# EAGLE schematic Display_Node (EAGLE 7.3.0)
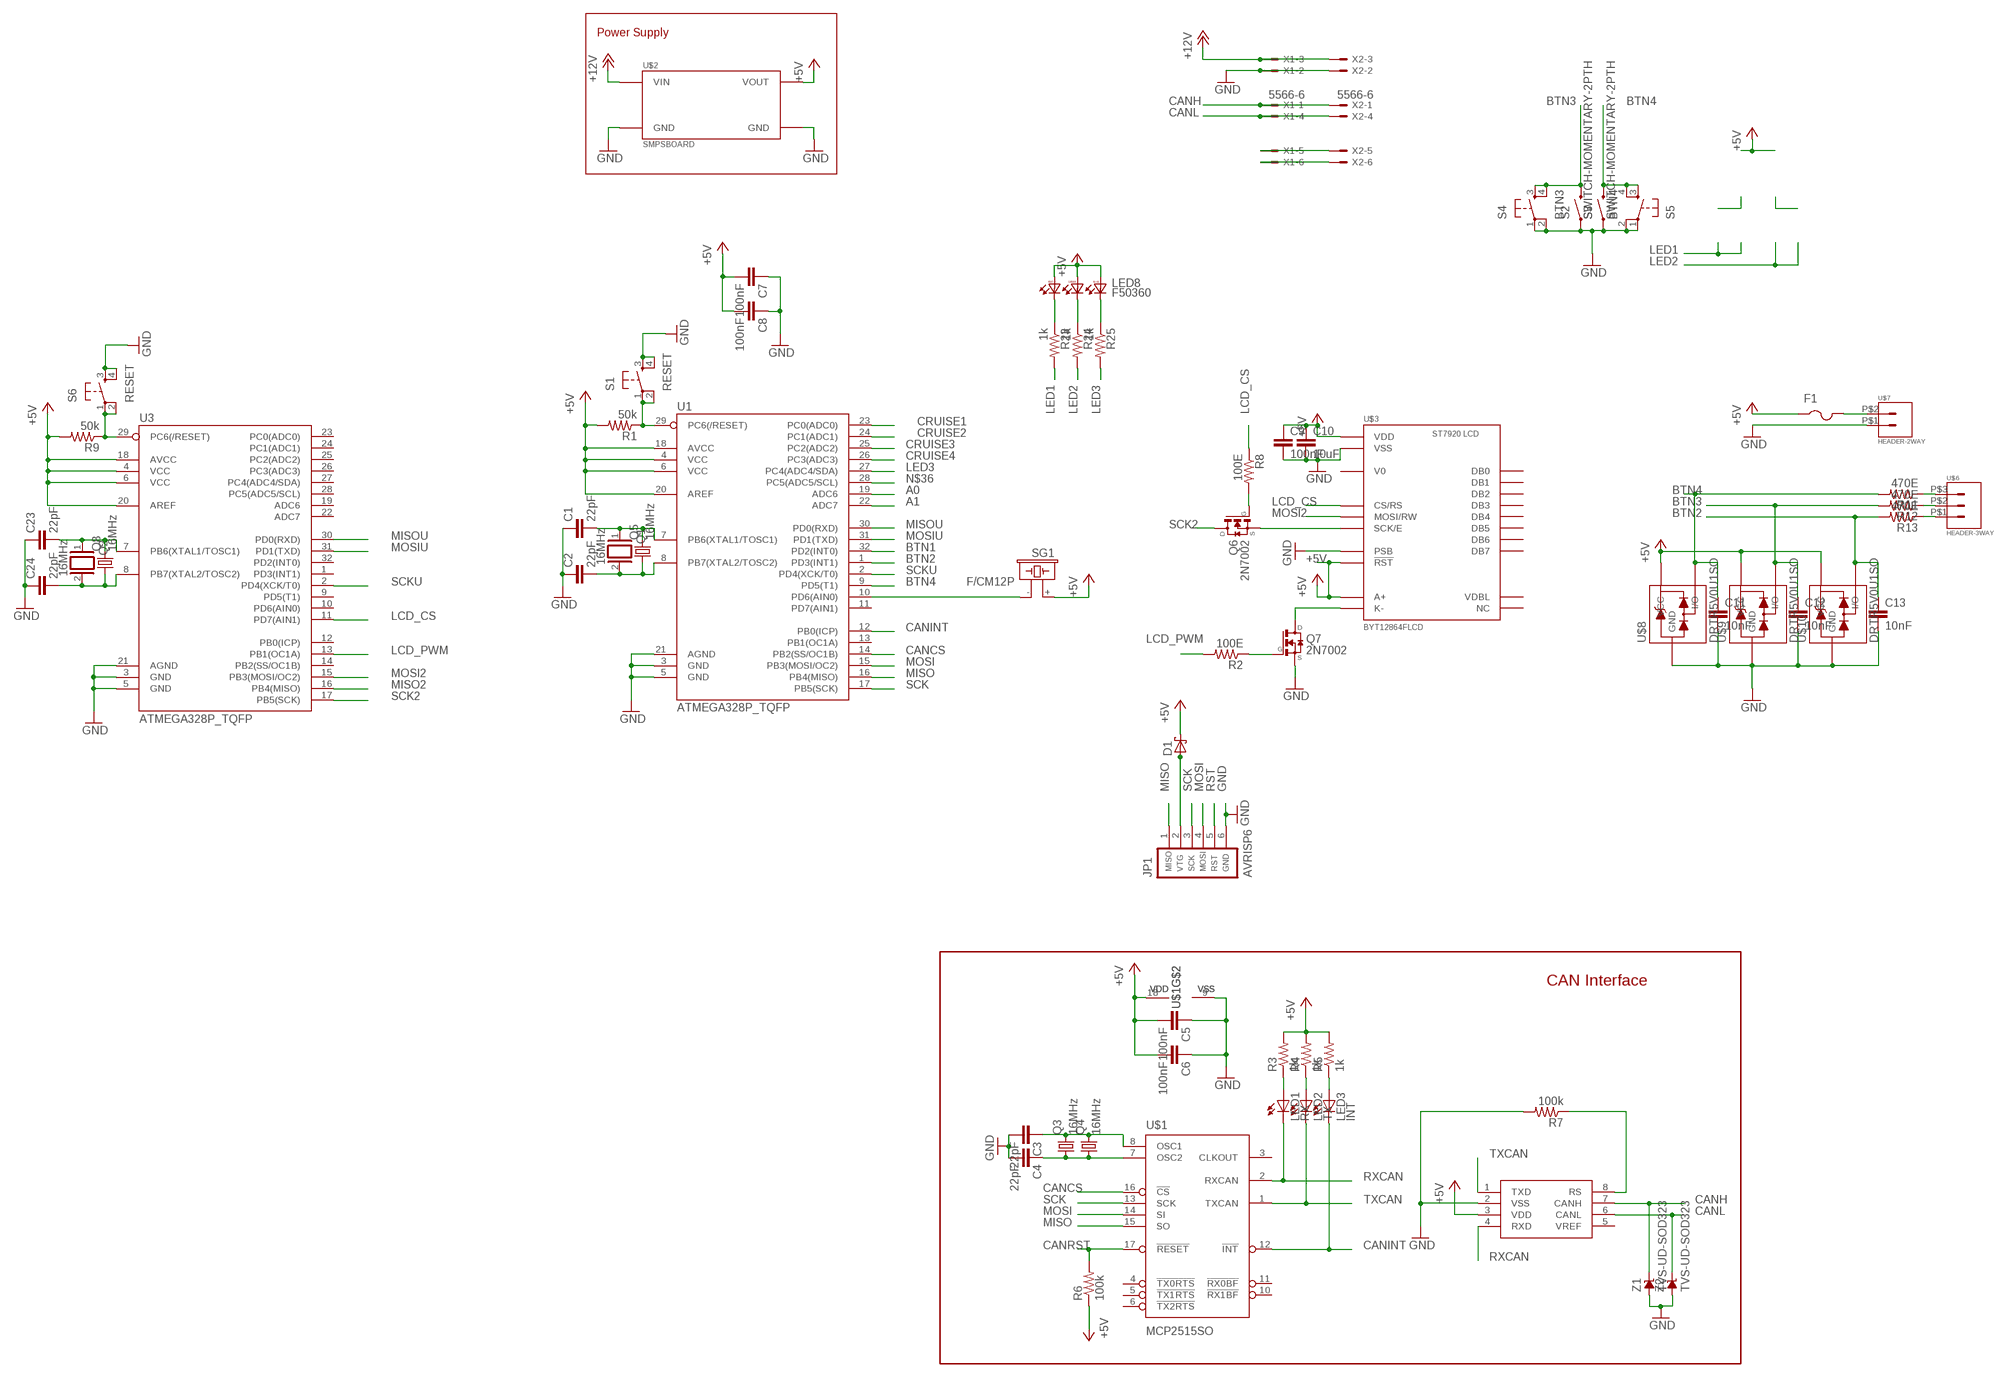
[diagram p0: schematic, sheet 1, part 1 of 2]
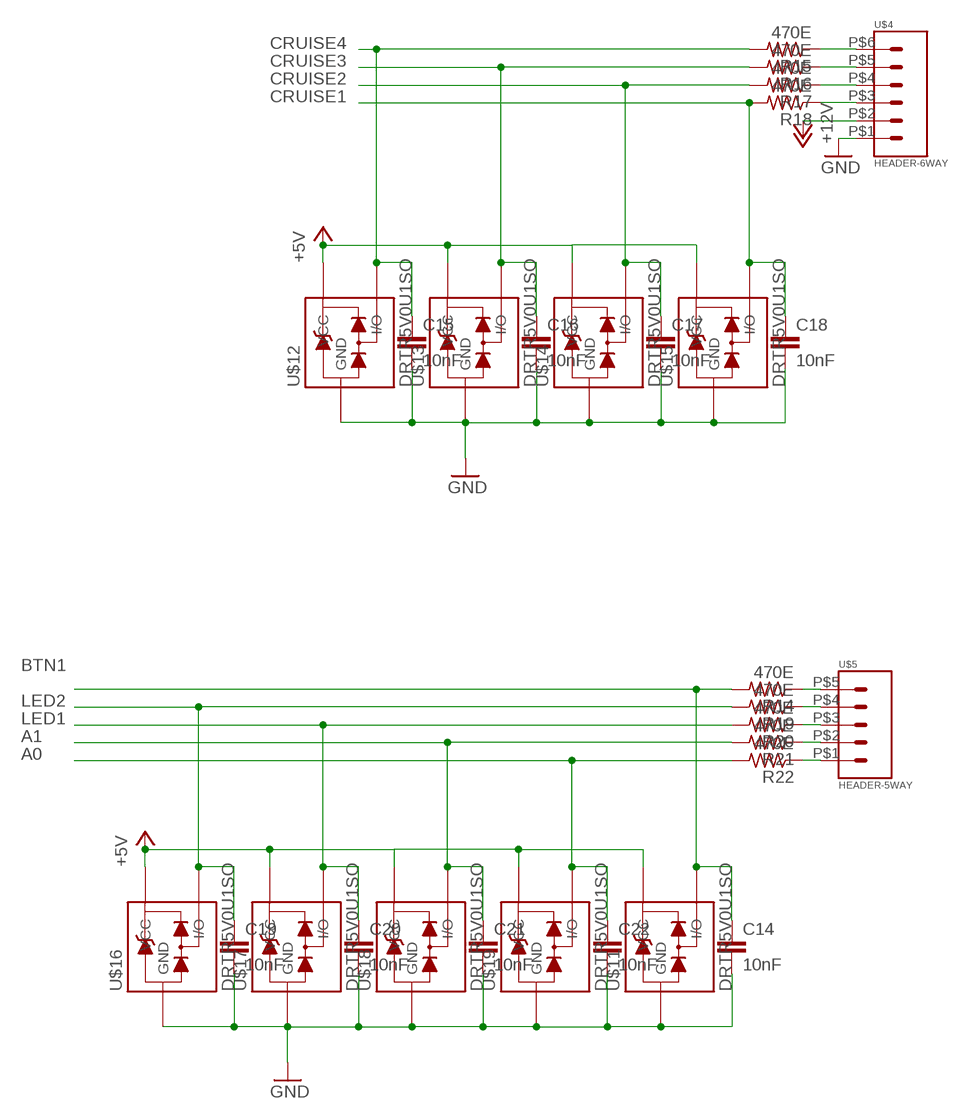
[diagram p1: schematic, sheet 1, part 2 of 2]

## Parts
C1  22pF  C-EUC0805  [C0805]
C2  22pF  C-EUC0805  [C0805]
C3  22pF  C-EUC0805K  [C0805K]
C4  22pF  C-EUC0805K  [C0805K]
C5  100nF  C-EUC0805K  [C0805K]
C6  100nF  C-EUC0805K  [C0805K]
C7  100nF  C-EUC0805  [C0805]
C8  100nF  C-EUC0805  [C0805]
C9  100nF  C-EUC0805  [C0805]
C10  10uF  C-EUC0805  [C0805]
C11  10nF  C-EUC0805  [C0805]
C12  10nF  C-EUC0805  [C0805]
C13  10nF  C-EUC0805  [C0805]
C14  10nF  C-EUC0805  [C0805]
C15  10nF  C-EUC0805  [C0805]
C16  10nF  C-EUC0805  [C0805]
C17  10nF  C-EUC0805  [C0805]
C18  10nF  C-EUC0805  [C0805]
C19  10nF  C-EUC0805  [C0805]
C20  10nF  C-EUC0805  [C0805]
C21  10nF  C-EUC0805  [C0805]
C22  10nF  C-EUC0805  [C0805]
C23  22pF  C-EUC0805  [C0805]
C24  22pF  C-EUC0805  [C0805]
D1  SCHOTTKY-DIODESMD  [SMB]
F1  PTCFUSE-1812  [1812]
JP1  AVRISP6  AVR-ISP6-75869-131  [HDR-75869-131]
LED1  RX  LEDCHIP-LED0805  [CHIP-LED0805]
LED2  TX  LEDCHIP-LED0805  [CHIP-LED0805]
LED3  INT  LEDCHIP-LED0805  [CHIP-LED0805]
LED8  F50360  [F50360]
Q1  16MHz  XTAL/S  [QS]
Q2  16MHz  XTAL/S  [QS]
Q3  16MHz  CRYSTALHC49S  [HC49/S]
Q4  16MHz  CRYSTALHC49UP  [HC49UP]
Q5  16MHz  CRYSTALHC49UP  [HC49UP]
Q6  2N7002  [SOT23]
Q7  2N7002  [SOT23]
Q8  16MHz  CRYSTALHC49UP  [HC49UP]
R1  50k  R-US_R0805  [R0805]
R2  100E  R-US_R0805  [R0805]
R3  1k  R-US_R0805  [R0805]
R4  1k  R-US_R0805  [R0805]
R5  1k  R-US_R0805  [R0805]
R6  100k  R-US_R0805  [R0805]
R7  100k  R-US_R0805  [R0805]
R8  100E  R-US_R0805  [R0805]
R9  50k  R-US_R0805  [R0805]
R11  470E  R-US_R0805  [R0805]
R12  470E  R-US_R0805  [R0805]
R13  470E  R-US_R0805  [R0805]
R14  470E  R-US_R0805  [R0805]
R15  470E  R-US_R0805  [R0805]
R16  470E  R-US_R0805  [R0805]
R17  470E  R-US_R0805  [R0805]
R18  470E  R-US_R0805  [R0805]
R19  470E  R-US_R0805  [R0805]
R20  470E  R-US_R0805  [R0805]
R21  470E  R-US_R0805  [R0805]
R22  470E  R-US_R0805  [R0805]
R23  1k  R-US_R0805  [R0805]
R24  1k  R-US_R0805  [R0805]
R25  1k  R-US_R0805  [R0805]
S1  RESET  TAC_SWITCHSMD  [TACTILE_SWITCH_SMD]
S2  SWITCH-MOMENTARY-2PTH  [TACTILE-PTH]
S3  SWITCH-MOMENTARY-2PTH  [TACTILE-PTH]
S4  BTN3  TAC_SWITCHSMD  [TACTILE_SWITCH_SMD]
S5  BTN4  TAC_SWITCHSMD  [TACTILE_SWITCH_SMD]
S6  RESET  TAC_SWITCHSMD  [TACTILE_SWITCH_SMD]
SG1  F/CM12P  [F/CM12P]
U1  ATMEGA328P_TQFP  [TQFP32-08]
U2  MCP2551  [SO08]
U3  ATMEGA328P_TQFP  [TQFP32-08]
U$1  MCP2515SO  [SO-18W]
U$2  SMPSBOARD  [SMPSBOARD]
U$3  BYT12864FLCD  [BYT12864F]
U$4  HEADER-6WAY  [1744426-6]
U$5  HEADER-5WAY  [1744426-5]
U$6  HEADER-3WAY  [1744426-3]
U$7  HEADER-2WAY  [1744426-2]
U$8  DRTR5V0U1SO  [SOT23]
U$9  DRTR5V0U1SO  [SOT23]
U$10  DRTR5V0U1SO  [SOT23]
U$11  DRTR5V0U1SO  [SOT23]
U$12  DRTR5V0U1SO  [SOT23]
U$13  DRTR5V0U1SO  [SOT23]
U$14  DRTR5V0U1SO  [SOT23]
U$15  DRTR5V0U1SO  [SOT23]
U$16  DRTR5V0U1SO  [SOT23]
U$17  DRTR5V0U1SO  [SOT23]
U$18  DRTR5V0U1SO  [SOT23]
U$19  DRTR5V0U1SO  [SOT23]
X1  5566-6  [5566-6]
X2  5566-6  [5566-6]
Z1  TVS-UD-SOD323  [SOD323]
Z2  TVS-UD-SOD323  [SOD323]

## Nets
+5V: C5.2 C6.2 C7.2 C8.2 C9.1 C10.1 D1.C F1.1 LED8.BA LED8.GA LED8.RA R1.2 R3.2 R4.2 R5.2 R6.1 R9.2 SG1.+ U1.4(VCC) U1.6(VCC) U1.18(AVCC) U1.20(AREF) U2.3(VDD) U$1.18(VDD) U$2.VOUT U$3.P$2(A+) U$3.P$4(!RST) U$3.P$19(VDD) U$8.2(VCC) U$9.2(VCC) U$10.2(VCC) U$11.2(VCC) U$12.2(VCC) U$13.2(VCC) U$14.2(VCC) U$15.2(VCC) U$16.2(VCC) U$17.2(VCC) U$18.2(VCC) U$19.2(VCC)
+12V: U$2.VIN U$4.P$2 X1.3 X2.3
A0: C22.1 R22.2 U1.19(ADC6) U$19.1(I/O)
A1: C21.1 R21.2 U1.22(ADC7) U$18.1(I/O)
BTN1: C14.1 R14.2 U1.32(PD2(INT0)) U$11.1(I/O)
BTN2: C13.1 R13.2 U1.1(PD3(INT1)) U$10.1(I/O)
BTN3: C12.1 R12.2 S2.3 S4.3 S4.4 U$9.1(I/O)
BTN4: C11.1 R11.2 S3.3 S5.3 S5.4 U1.9(PD5(T1)) U$8.1(I/O)
CANCS: U1.14(PB2(SS/OC1B)) U$1.16(!CS)
CANH: U2.7(CANH) X1.1 X2.1 Z1.C
CANINT: LED3.C U1.12(PB0(ICP)) U$1.12(!INT)
CANL: U2.6(CANL) X1.4 X2.4 Z2.C
CANRST: R6.2 U$1.17(!RESET)
CANSTBY: R7.1 U2.8(RS)
CRUISE1: C18.1 R18.2 U1.23(PC0(ADC0)) U$15.1(I/O)
CRUISE2: C17.1 R17.2 U1.24(PC1(ADC1)) U$14.1(I/O)
CRUISE3: C16.1 R16.2 U1.25(PC2(ADC2)) U$13.1(I/O)
CRUISE4: C15.1 R15.2 U1.26(PC3(ADC3)) U$12.1(I/O)
GND: C1.1 C2.1 C3.2 C4.2 C5.1 C6.1 C7.1 C8.1 C9.2 C10.2 C11.2 C12.2 C13.2 C14.2 C15.2 C16.2 C17.2 C18.2 C19.2 C20.2 C21.2 C22.2 C23.1 C24.1 JP1.6 Q7.2(S) R7.2 S1.3 S1.4 S2.1 S3.1 S4.1 S4.2 S5.1 S5.2 S6.3 S6.4 U1.3(GND) U1.5(GND) U1.21(AGND) U2.2(VSS) U$1.9(VSS) U$2.GND U$2.GND@(GND) U$3.P$6(PSB) U$3.P$20(VSS) U$4.P$1 U$7.P$1 U$8.3(GND) U$9.3(GND) U$10.3(GND) U$11.3(GND) U$12.3(GND) U$13.3(GND) U$14.3(GND) U$15.3(GND) U$16.3(GND) U$17.3(GND) U$18.3(GND) U$19.3(GND) X1.2 X2.2 Z1.A Z2.A
LCD_CS: R8.1 U3.11(PD7(AIN1)) U$3.P$17(CS/RS)
LCD_PWM: R2.2 U3.13(PB1(OC1A))
LED1: C20.1 R20.2 R23.2 U$17.1(I/O)
LED2: C19.1 R19.2 R24.2 U$16.1(I/O)
LED3: R25.2 U1.27(PC4(ADC4/SDA))
MISO: JP1.1 U1.16(PB4(MISO)) U$1.15(SO)
MISO2: U3.16(PB4(MISO))
MISOU: U1.30(PD0(RXD)) U3.30(PD0(RXD))
MOSI: JP1.4 U1.15(PB3(MOSI/OC2)) U$1.14(SI)
MOSI2: U3.15(PB3(MOSI/OC2)) U$3.P$16(MOSI/RW)
MOSIU: U1.31(PD1(TXD)) U3.31(PD1(TXD))
N$1: C1.2 Q1.1 Q5.2 U1.7(PB6(XTAL1/TOSC1))
N$2: C2.2 Q1.2 Q5.1 U1.8(PB7(XTAL2/TOSC2))
N$3: C3.1 Q3.2 Q4.2 U$1.8(OSC1)
N$4: Q7.3(D) U$3.P$1(K-)
N$5: Q7.1(G) R2.1
N$6: C4.1 Q3.1 Q4.1 U$1.7(OSC2)
N$7: LED1.A R3.1
N$8: LED2.A R4.1
N$9: LED3.A R5.1
N$10: D1.A JP1.2
N$11: Q6.2(S) U$3.P$15(SCK/E)
N$12: Q6.1(G) R8.2
N$14: X1.5 X2.5
N$15: X1.6 X2.6
N$17: F1.2 U$7.P$2
N$18: R11.1 U$6.P$3
N$19: R12.1 U$6.P$2
N$20: R13.1 U$6.P$1
N$21: R14.1 U$5.P$5
N$22: R18.1 U$4.P$3
N$23: R17.1 U$4.P$4
N$24: R16.1 U$4.P$5
N$25: R15.1 U$4.P$6
N$26: R19.1 U$5.P$4
N$27: R20.1 U$5.P$3
N$28: R21.1 U$5.P$2
N$29: R22.1 U$5.P$1
N$30: SG1.- U1.10(PD6(AIN0))
N$31: LED8.RC R23.1
N$32: LED8.GC R24.1
N$33: LED8.BC R25.1
N$34: C23.2 Q2.1 Q8.2 U3.7(PB6(XTAL1/TOSC1))
N$35: C24.2 Q2.2 Q8.1 U3.8(PB7(XTAL2/TOSC2))
N$36: U1.28(PC5(ADC5/SCL))
RST: JP1.5 R1.1 S1.1 S1.2 U1.29(PC6(/RESET))
RST1: R9.1 S6.1 S6.2
RXCAN: LED1.C U2.4(RXD) U$1.2(RXCAN)
SCK: JP1.3 U1.17(PB5(SCK)) U$1.13(SCK)
SCK2: Q6.3(D) U3.17(PB5(SCK))
SCKU: U1.2(PD4(XCK/T0)) U3.2(PD4(XCK/T0))
TXCAN: LED2.C U2.1(TXD) U$1.1(TXCAN)
Unconnected: U1.11(PD7(AIN1)) U1.13(PB1(OC1A)) U2.5(VREF) U3.1(PD3(INT1)) U3.3(GND) U3.4(VCC) U3.5(GND) U3.6(VCC) U3.9(PD5(T1)) U3.10(PD6(AIN0)) U3.12(PB0(ICP)) U3.14(PB2(SS/OC1B)) U3.18(AVCC) U3.19(ADC6) U3.20(AREF) U3.21(AGND) U3.22(ADC7) U3.23(PC0(ADC0)) U3.24(PC1(ADC1)) U3.25(PC2(ADC2)) U3.26(PC3(ADC3)) U3.27(PC4(ADC4/SDA)) U3.28(PC5(ADC5/SCL)) U3.29(PC6(/RESET)) U3.32(PD2(INT0)) U$1.3(CLKOUT) U$1.4(!TX0RTS) U$1.5(!TX1RTS) U$1.6(!TX2RTS) U$1.10(!RX1BF) U$1.11(!RX0BF) U$3.P$3(VDBL) U$3.P$5(NC) U$3.P$7(DB7) U$3.P$8(DB6) U$3.P$9(DB5) U$3.P$10(DB4) U$3.P$11(DB3) U$3.P$12(DB2) U$3.P$13(DB1) U$3.P$14(DB0) U$3.P$18(V0)

## Notes on the sheet
- Power Supply
- CAN Interface

## Library data of the parts
C1-C24 = resistor:C-EU: CAPACITOR, European symbol
D1 = diode:SCHOTTKY-DIODE: Schottky Diode
F1 = adafruit:PTCFUSE: PTC fuses, resettable thermistors
JP1 = atmel-avr:AVR-ISP6-: AVR ISP-6 Serial Programming Header
LED1-LED3 = led:LED: LED OSRAM: - CHIPLED LG R971, LG N971, LY N971, LG Q971, LY Q971, LO R971, LY R971 LH N974, LH R974 LS Q976, LO Q976, LY Q976 LO Q996 - Hyper CHIPLED LW Q18S LB Q993, LB Q99A, LB R99A - SideLED LS A670, LO A670, LY A670, LG A670, LP A670 LB A673, LV A673, LT A673, LW A673 LH A674 LY A675 LS A676, LA A676, LO A676, LY A676, LW A676 LS A679, LY A679, LG A679 - Hyper Micro SIDELED® LS Y876, LA Y876, LO Y876, LY Y876 LT Y87S - SmartLED LW L88C, LW L88S LB L89C, LB L89S, LG L890 LS L89K, LO L89K, LY L89K LS L896, LA L896, LO L896, LY L896 - TOPLED LS T670, LO T670, LY T670, LG T670, LP T670 LSG T670, LSP T670, LSY T670, LOP T670, LYG T670 LG T671, LOG T671, LSG T671 LB T673, LV T673, LT T673, LW T673 LH T674 LS T676, LA T676, LO T676, LY T676, LB T676, LH T676, LSB T676, LW T676 LB T67C, LV T67C, LT T67C, LS T67K, LO T67K, LY T67K, LW E67C LS E67B, LA E67B, LO E67B, LY E67B, LB E67C, LV E67C, LT E67C LW T67C LS T679, LY T679, LG T679 LS T770, LO T770, LY T770, LG T770, LP T770 LB T773, LV T773, LT T773, LW T773 LH T774 LS E675, LA E675, LY E675, LS T675 LS T776, LA T776, LO T776, LY T776, LB T776 LHGB T686 LT T68C, LB T68C - Hyper Mini TOPLED® LB M676 - Mini TOPLED Santana® LG M470 LS M47K, LO M47K, LY M47K Source: http://www.osram.convergy.de LUXEON: - LUMILED® LXK2-PW12-R00, LXK2-PW12-S00, LXK2-PW14-U00, LXK2-PW14-V00 LXK2-PM12-R00, LXK2-PM12-S00, LXK2-PM14-U00 LXK2-PE12-Q00, LXK2-PE12-R00, LXK2-PE12-S00, LXK2-PE14-T00, LXK2-PE14-U00 LXK2-PB12-K00, LXK2-PB12-L00, LXK2-PB12-M00, LXK2-PB14-N00, LXK2-PB14-P00, LXK2-PB14-Q00 LXK2-PR12-L00, LXK2-PR12-M00, LXK2-PR14-Q00, LXK2-PR14-R00 LXK2-PD12-Q00, LXK2-PD12-R00, LXK2-PD12-S00 LXK2-PH12-R00, LXK2-PH12-S00 LXK2-PL12-P00, LXK2-PL12-Q00, LXK2-PL12-R00 Source: www.luxeon.com KINGBRIGHT: KA-3528ASYC Source: www.kingbright.com
LED8 = led:F50360: Full color Z-Power LED RGB P5-II Series Source: http://www.seoulsemicon.co.kr .. F50360.pdf
Q1 Q2 = special:XTAL/S: CRYSTAL
Q3 = crystal:CRYSTAL: CRYSTAL; OC_FARNELL: 1667008; OC_NEWARK: unknown
Q4 Q5 Q8 = crystal:CRYSTAL: CRYSTAL; OC_FARNELL: unknown; OC_NEWARK: unknown
Q6 Q7 = transistor-fet:2N7002*: N-Channel MOSFET
R1-R9 R11-R25 = resistor:R-US_: RESISTOR, American symbol
S1 S4-S6 = SparkFun:TAC_SWITCH: Momentary Switch Button commonly used for reset or general input. Spark Fun Electronics SKU : COM-00097
S2 S3 = SparkFun:SWITCH-MOMENTARY-2
SG1 = buzzer:F/CM12P: BUZZER Source: Buerklin; OC_FARNELL: unknown; OC_NEWARK: unknown
U1 U3 = SparkFun-DigitalIC:ATMEGA328P_TQFP; PROD_ID: IC-09069
U2 = SparkFun:MCP2551
U$1 = RobThePyro:MCP2515: MCP2515 CAN Controller by Microchip
U$2 = RobThePyro:SMPSBOARD
U$3 = RobThePyro:BYT12864FLCD: ST7920 / BYT12864F Based GFX LCD
U$4 = con-TE-EP:HEADER-6WAY
U$5 = con-TE-EP:HEADER-5WAY
U$6 = con-TE-EP:HEADER-3WAY
U$7 = con-TE-EP:HEADER-2WAY
U$8-U$19 = RobThePyro:DRTR5V0U1SO: NewDiodesZetex DRTR5V0U1SO-7, Uni-Directional TVS Diode Array Array, 300mW, 3-Pin SOT-23 http://za.rs-online.com/web/p/tvs-diodes/8270418/
X1 X2 = con-molex:5566-6: Mini FIT connector 6 pol Source: http://www.molex.com; MPN: 95566-61002; OC_FARNELL: unknown; OC_NEWARK: 22K8620
Z1 Z2 = supressor:TVS-UD-: TVS UNI-DIRECTIONAL